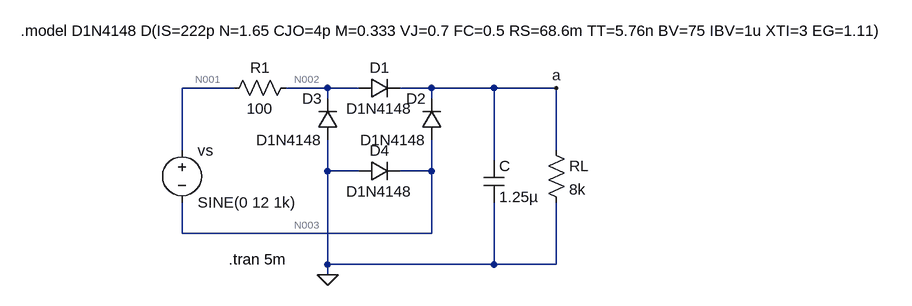
[diagram p0: schematic ej3.2.asc]
ej3.2.asc, the LTspice schematic file:
Version 4.1
SHEET 1 1136 680
WIRE 16 16 -64 16
WIRE 160 16 96 16
WIRE 208 16 160 16
WIRE 320 16 272 16
WIRE 416 16 320 16
WIRE 512 16 416 16
WIRE 160 32 160 16
WIRE 320 32 320 16
WIRE -64 112 -64 16
WIRE 512 112 512 16
WIRE 416 128 416 16
WIRE 160 144 160 96
WIRE 208 144 160 144
WIRE 320 144 320 96
WIRE 320 144 272 144
WIRE -64 240 -64 192
WIRE 320 240 320 144
WIRE 320 240 -64 240
WIRE 160 288 160 144
WIRE 416 288 416 192
WIRE 416 288 160 288
WIRE 512 288 512 192
WIRE 512 288 416 288
WIRE 160 304 160 288
FLAG 512 16 a
FLAG 160 304 0
SYMBOL voltage -64 96 R0
WINDOW 123 0 0 Left 0
WINDOW 39 0 0 Left 0
SYMATTR InstName vs
SYMATTR Value SINE(0 12 1k)
SYMBOL res 112 0 R90
WINDOW 0 0 56 VBottom 2
WINDOW 3 32 56 VTop 2
SYMATTR InstName R1
SYMATTR Value 100
SYMBOL diode 176 96 R180
WINDOW 0 24 64 Left 2
WINDOW 3 24 0 Left 2
SYMATTR InstName D3
SYMATTR Value D1N4148
SYMBOL diode 208 32 R270
WINDOW 0 32 32 VTop 2
WINDOW 3 0 32 VBottom 2
SYMATTR InstName D1
SYMATTR Value D1N4148
SYMBOL diode 336 96 R180
WINDOW 0 24 64 Left 2
WINDOW 3 24 0 Left 2
SYMATTR InstName D2
SYMATTR Value D1N4148
SYMBOL diode 208 160 R270
WINDOW 0 32 32 VTop 2
WINDOW 3 0 32 VBottom 2
SYMATTR InstName D4
SYMATTR Value D1N4148
SYMBOL cap 400 128 R0
SYMATTR InstName C
SYMATTR Value 1.25µ
SYMBOL res 496 96 R0
SYMATTR InstName RL
SYMATTR Value 8k
TEXT -312 -72 Left 2 !.model D1N4148 D(IS=222p N=1.65 CJO=4p M=0.333 VJ=0.7 FC=0.5 RS=68.6m TT=5.76n BV=75 IBV=1u XTI=3 EG=1.11)
TEXT 8 280 Left 2 !.tran 5m

The netlist it stands for:
* ej3.2.asc
vs N001 N003 SINE(0 12 1k)
R1 N002 N001 100
D3 0 N002 D1N4148
D1 N002 a D1N4148
D2 N003 a D1N4148
D4 0 N003 D1N4148
C a 0 1.25µ
RL a 0 8k
.model D D
.lib standard.dio
.model D1N4148 D(IS=222p N=1.65 CJO=4p M=0.333 VJ=0.7 FC=0.5 RS=68.6m TT=5.76n BV=75 IBV=1u XTI=3 EG=1.11)
.tran 5m
.backanno
.end

* Results of the author's LTspice run, read from the files saved beside the schematic
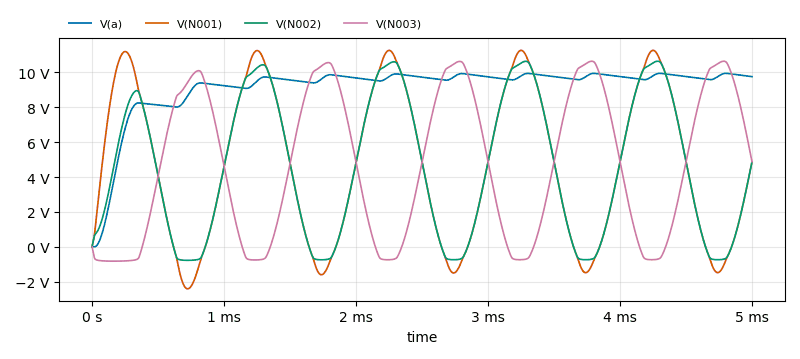
[diagram p1: Transient Analysis of ej3.2.asc, plotted from the saved traces]
* Transient Analysis, 1 run:
*   V(a): min 0 V, max 9.946 V, average 9.165 V, rms 9.313 V, last 9.756 V
*   V(N001): min -2.406 V, max 11.26 V, average 4.671 V, rms 6.392 V, last 4.878 V
*   V(N002): min -774.1 mV, max 10.64 V, average 4.494 V, rms 6.042 V, last 4.878 V
*   V(N003): min -822.9 mV, max 10.64 V, average 4.671 V, rms 6.29 V, last 4.878 V